# Altium schematic sheet bottom.SchDoc
size A4
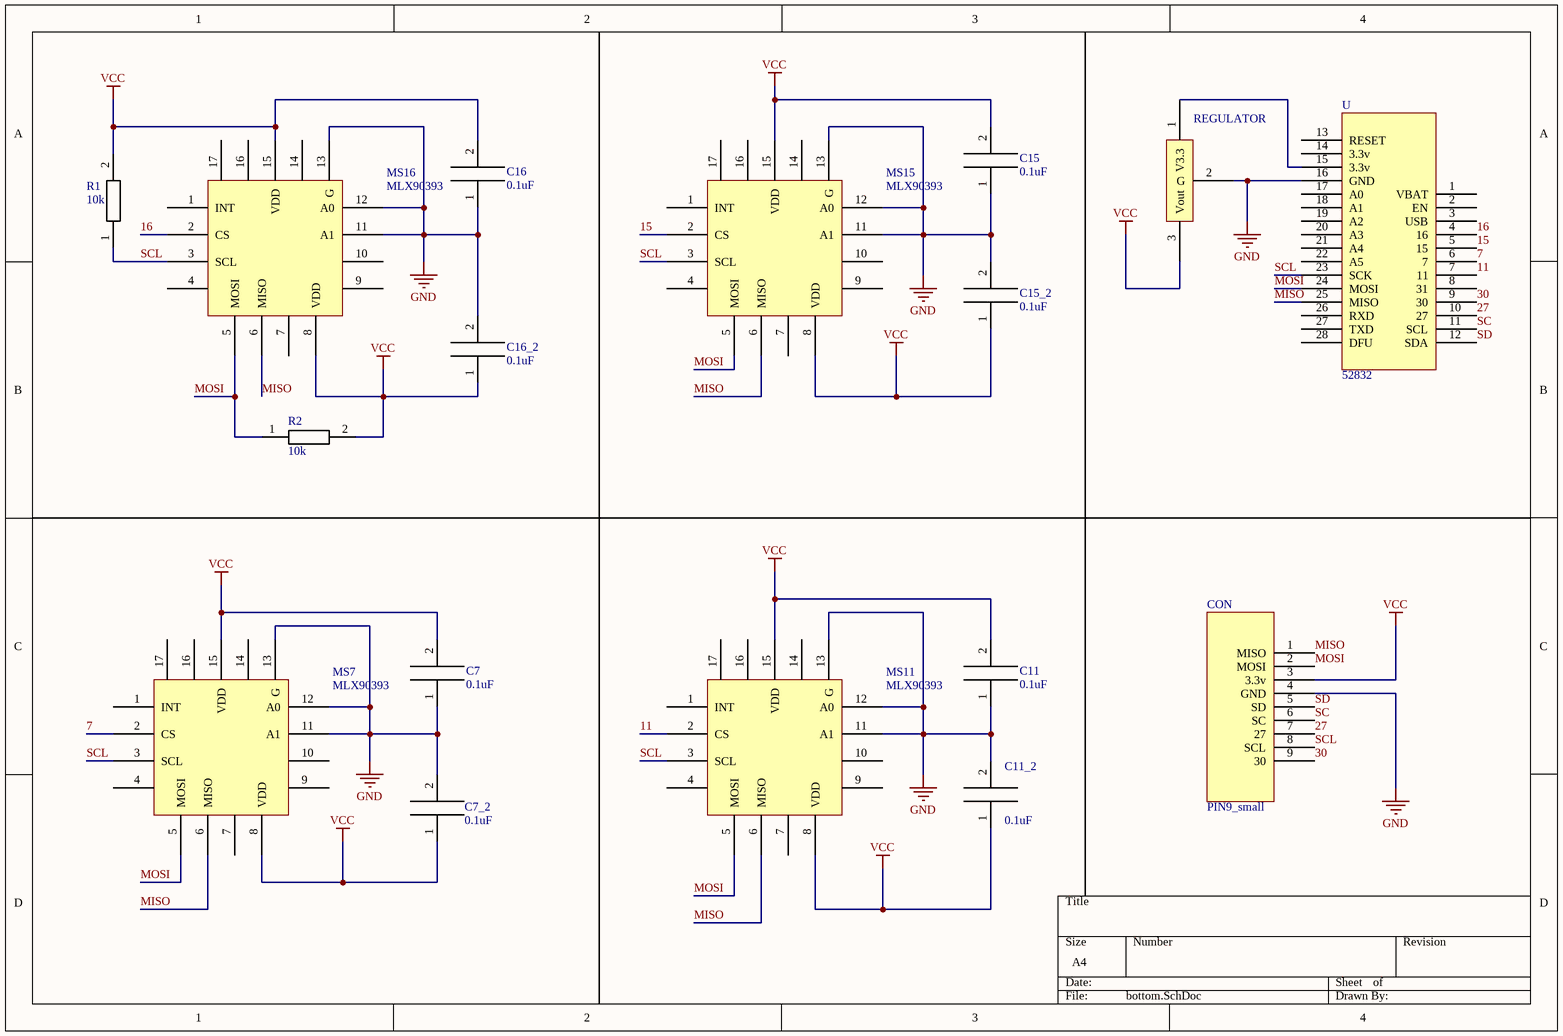
[diagram p0: bottom.SchDoc]

## Parts
?  REGULATOR  [linear regulator]
C7  0.1uF  [CAP_0603]
C7_2  0.1uF  [CAP_0603]
C11  0.1uF  [CAP_0603]
C11_2  0.1uF  [CAP_0603]
C15  0.1uF  [CAP_0603]
C15_2  0.1uF  [CAP_0603]
C16  0.1uF  [CAP_0603]
C16_2  0.1uF  [CAP_0603]
CON  PIN9_small  [PIN9_small]
MS7  MLX90393  [MLX90393]
MS11  MLX90393  [MLX90393]
MS15  MLX90393  [MLX90393]
MS16  MLX90393  [MLX90393]
R1  10k  [RES_0603]
R2  10k  [RES_0603]
U  52832  [feather]

## Nets
GND: ?.2(G) C7.1 C7_2.2 C11.1 C11_2.2 C15.1 C15_2.2 C16.1 C16_2.2 CON.4(GND) MS7.11(A1) MS7.12(A0) MS7.13(G) MS11.11(A1) MS11.12(A0) MS11.13(G) MS15.11(A1) MS15.12(A0) MS15.13(G) MS16.11(A1) MS16.12(A0) MS16.13(G) U.16(GND)
VCC: ?.3(Vout) C7.2 C7_2.1 C11.2 C11_2.1 C15.2 C15_2.1 C16.2 C16_2.1 CON.3(3.3v) MS7.8(VDD) MS7.15(VDD) MS11.8(VDD) MS11.15(VDD) MS15.8(VDD) MS15.15(VDD) MS16.8(VDD) MS16.15(VDD) R1.2 R2.2
7: MS7.2(CS) U.6(7)
11: MS11.2(CS) U.7(11)
15: MS15.2(CS) U.5(15)
16: MS16.2(CS) U.4(16)
27: CON.7(27) U.10(27)
30: CON.9(30) U.9(30)
MISO: CON.1(MISO) MS7.6(MISO) MS11.6(MISO) MS15.6(MISO) MS16.6(MISO) U.25(MISO)
MOSI: CON.2(MOSI) MS7.5(MOSI) MS11.5(MOSI) MS15.5(MOSI) MS16.5(MOSI) R2.1 U.24(MOSI)
SC: CON.6(SC) U.11(SCL)
SCL: CON.8(SCL) MS7.3(SCL) MS11.3(SCL) MS15.3(SCL) MS16.3(SCL) R1.1 U.23(SCK)
SD: CON.5(SD) U.12(SDA)
Net?_1: ?.1(V3.3) U.15(3.3v)

Not connected (* = marked no-connect by the designer): MS7 1(INT) 4 7 9 10 14 16 17; MS11 1(INT) 4 7 9 10 14 16 17; MS15 1(INT) 4 7 9 10 14 16 17; MS16 1(INT) 4 7 9 10 14 16 17; U 1(VBAT) 2(EN) 3(USB) 8(31) 13(RESET) 14(3.3v) 17(A0) 18(A1) 19(A2) 20(A3) 21(A4) 22(A5) 26(RXD) 27(TXD) 28(DFU)

## Library data of the parts
? = REGULATOR: linear regulator
C7 C7_2 C11 C11_2 C15 C15_2 C16 C16_2 = CAP: capacitance
MS7 MS11 MS15 MS16 = MLX90393: sensor
R1 R2 = RES: resistance
U = Feather: IC